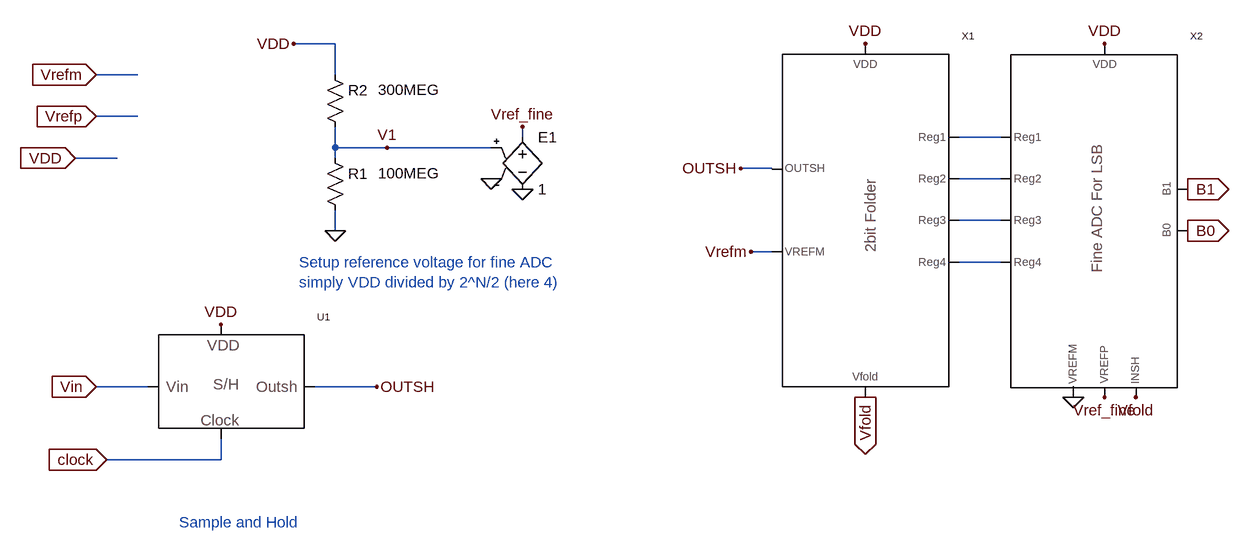
[diagram p0: schematic 2_bit_Folding_ADC.asc]
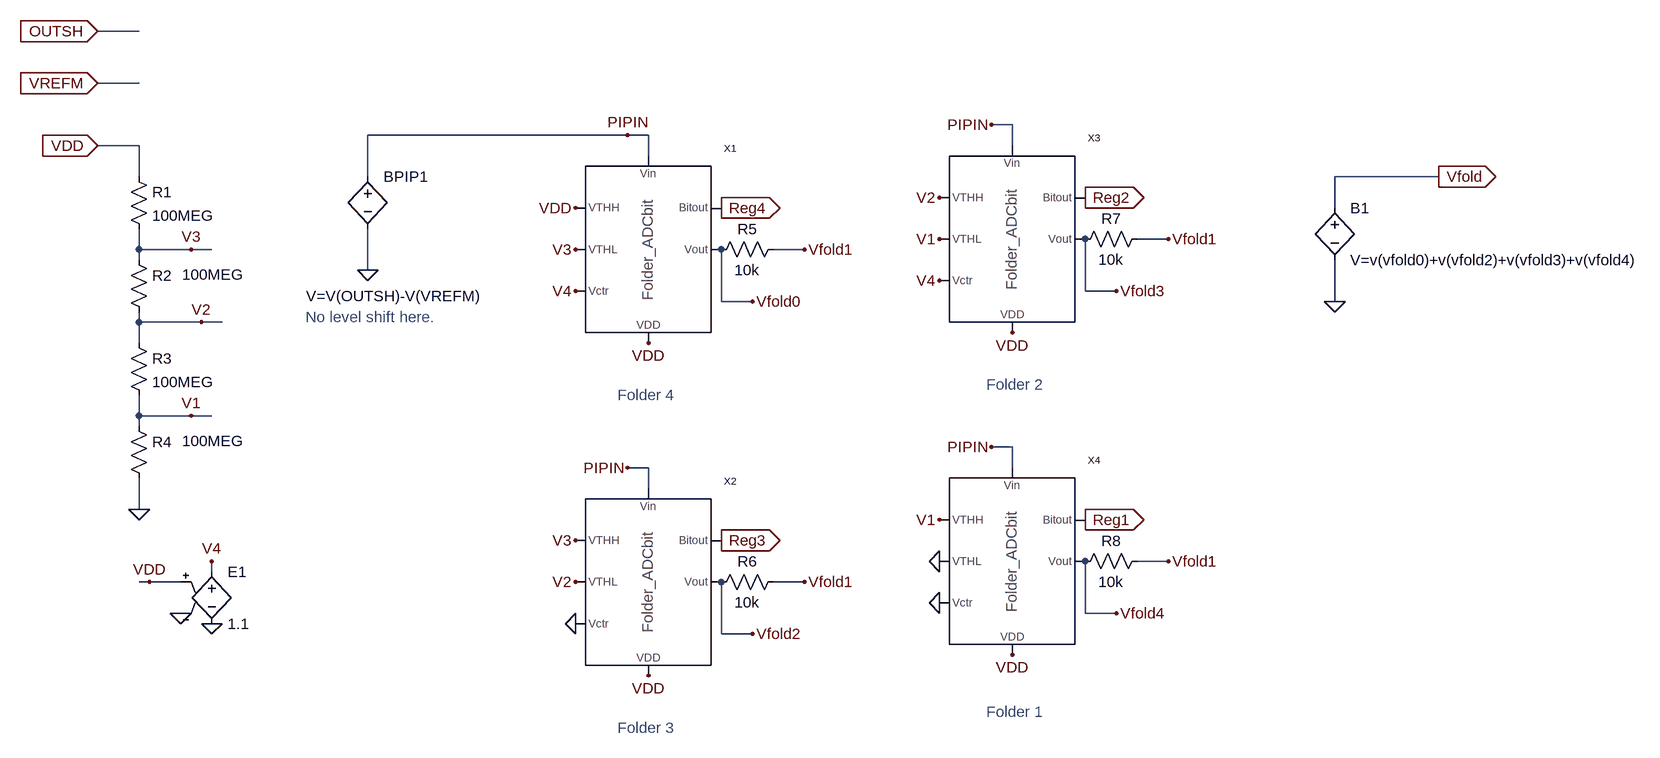
[diagram p1: sub-circuit 2bit_folder.asc]
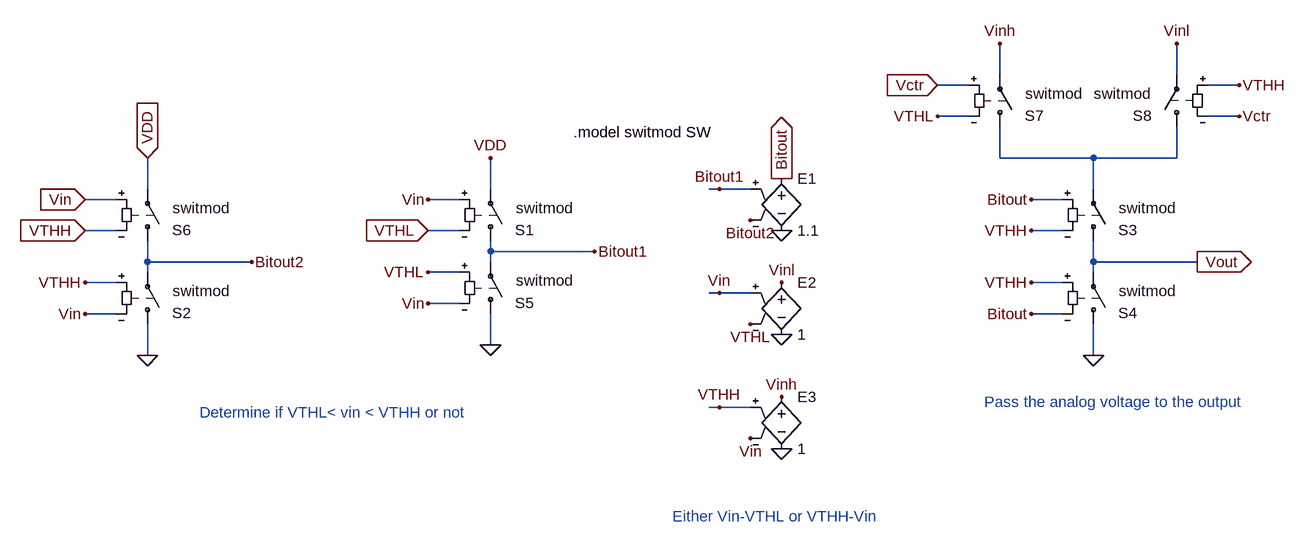
[diagram p2: sub-circuit folder_adcbit.asc]
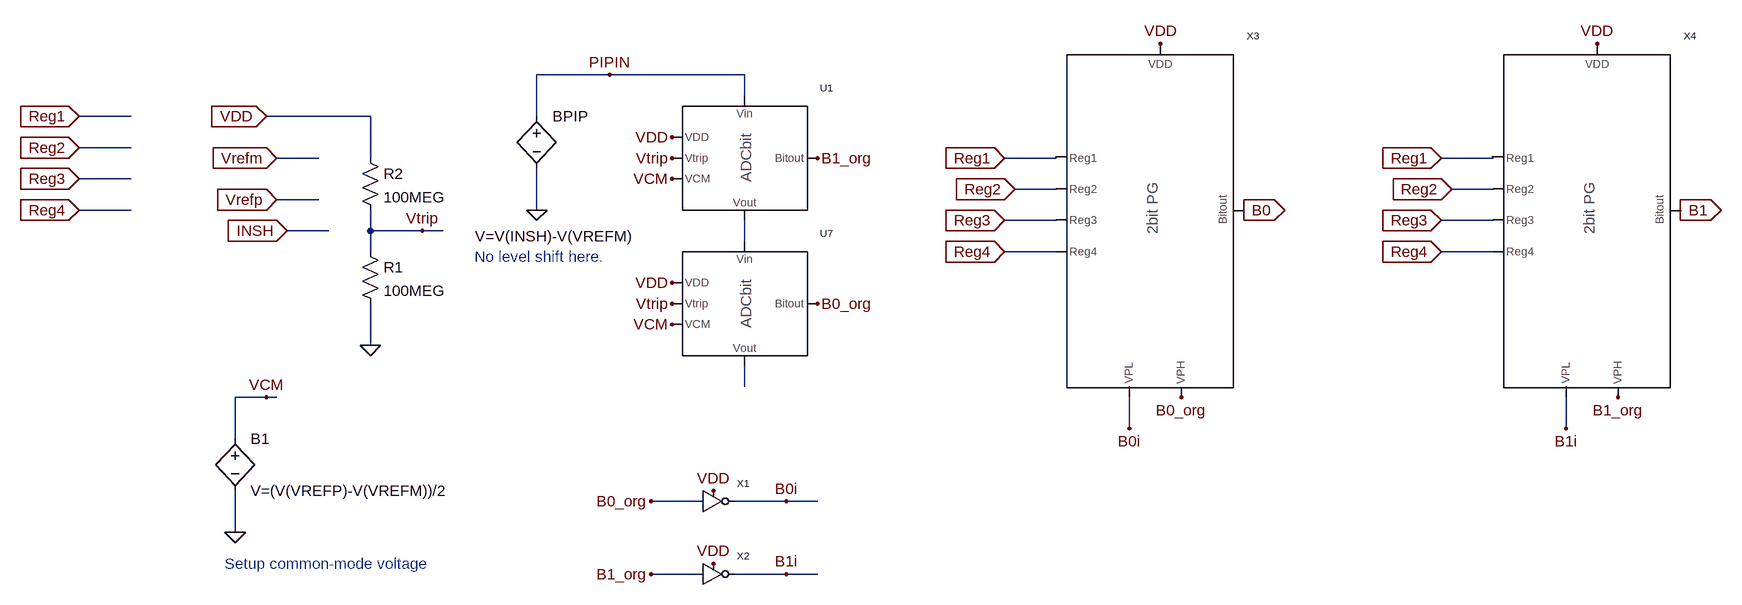
[diagram p3: sub-circuit 2_bit_fine_adc_lsb.asc]
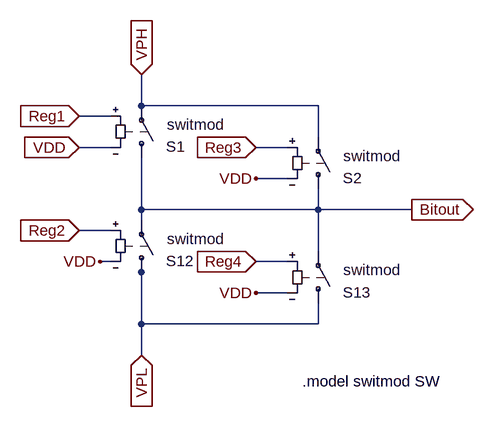
[diagram p4: sub-circuit 2bit_pg.asc]
2_bit_Folding_ADC.asc, the LTspice schematic file:
Version 4
SHEET 1 880 680
WIRE -1184 -960 -1248 -960
WIRE -1488 -912 -1552 -912
WIRE -1184 -912 -1184 -960
WIRE -1488 -848 -1552 -848
WIRE -896 -816 -896 -832
WIRE -160 -816 -224 -816
WIRE -1184 -800 -1184 -832
WIRE -1104 -800 -1184 -800
WIRE -944 -800 -1104 -800
WIRE -1520 -784 -1584 -784
WIRE -1184 -784 -1184 -800
WIRE -512 -768 -560 -768
WIRE -160 -752 -224 -752
WIRE -160 -688 -224 -688
WIRE -1184 -672 -1184 -704
WIRE -512 -640 -544 -640
WIRE -160 -624 -224 -624
WIRE -1472 -432 -1552 -432
WIRE -1120 -432 -1216 -432
WIRE -1360 -320 -1360 -352
WIRE -1360 -320 -1536 -320
FLAG -1536 -320 clock
IOPIN -1536 -320 In
FLAG -1120 -432 OUTSH
FLAG -1184 -672 0
FLAG -1248 -960 VDD
FLAG -1552 -432 Vin
IOPIN -1552 -432 In
FLAG -1552 -912 Vrefm
IOPIN -1552 -912 In
FLAG -1552 -848 Vrefp
IOPIN -1552 -848 In
FLAG -1360 -528 VDD
FLAG -1104 -800 V1
FLAG 128 -672 B0
IOPIN 128 -672 Out
FLAG -896 -736 0
FLAG -896 -832 Vref_fine
FLAG -944 -752 0
FLAG -544 -640 Vrefm
FLAG -368 -960 VDD
FLAG -368 -416 Vfold
IOPIN -368 -416 Out
FLAG -1584 -784 VDD
IOPIN -1584 -784 In
FLAG 0 -416 Vref_fine
FLAG -48 -416 0
FLAG 48 -416 Vfold
FLAG 0 -960 VDD
FLAG -560 -768 OUTSH
FLAG 128 -736 B1
IOPIN 128 -736 Out
SYMBOL Sample_and_hold -1456 -368 R0
SYMATTR InstName U1
SYMBOL res -1200 -928 R0
WINDOW 3 82 39 Left 0
SYMATTR Value 300MEG
SYMATTR InstName R2
SYMBOL res -1200 -800 R0
WINDOW 3 82 39 Left 0
SYMATTR Value 100MEG
SYMATTR InstName R1
SYMBOL e -896 -832 R0
SYMATTR InstName E1
SYMATTR Value 1
SYMBOL 2bit_folder -448 -560 R0
SYMATTR InstName X1
SYMBOL 2_bit_fine_adc_lsb 0 -640 R0
SYMATTR InstName X2
TEXT -1424 -224 Left 0 ;Sample and Hold
TEXT -1240 -624 Left 0 ;Setup reference voltage for fine ADC\nsimply VDD divided by 2^N/2 (here 4)

2bit_folder.asc, the sub-circuit schematic file:
Version 4
SHEET 1 880 680
WIRE -1984 -1616 -2048 -1616
WIRE -1984 -1536 -2048 -1536
WIRE -640 -1472 -672 -1472
WIRE -1232 -1456 -1632 -1456
WIRE -1200 -1456 -1232 -1456
WIRE -1984 -1440 -2048 -1440
WIRE -640 -1440 -640 -1472
WIRE -1200 -1424 -1200 -1456
WIRE -1984 -1392 -1984 -1440
WIRE -1632 -1392 -1632 -1456
WIRE 16 -1392 -144 -1392
WIRE -144 -1344 -144 -1392
WIRE -400 -1296 -448 -1296
WIRE -1984 -1280 -1984 -1312
WIRE -1904 -1280 -1984 -1280
WIRE -1872 -1280 -1904 -1280
WIRE -960 -1280 -1008 -1280
WIRE -1984 -1264 -1984 -1280
WIRE -1632 -1248 -1632 -1312
WIRE -528 -1216 -528 -1296
WIRE -480 -1216 -528 -1216
WIRE -1088 -1200 -1088 -1280
WIRE -1040 -1200 -1088 -1200
WIRE -144 -1200 -144 -1264
WIRE -1984 -1168 -1984 -1184
WIRE -1888 -1168 -1984 -1168
WIRE -1856 -1168 -1888 -1168
WIRE -1984 -1136 -1984 -1168
WIRE -1984 -1024 -1984 -1056
WIRE -1904 -1024 -1984 -1024
WIRE -1872 -1024 -1904 -1024
WIRE -1984 -1008 -1984 -1024
WIRE -640 -976 -672 -976
WIRE -1200 -944 -1232 -944
WIRE -640 -944 -640 -976
WIRE -1200 -912 -1200 -944
WIRE -1984 -880 -1984 -928
WIRE -400 -800 -448 -800
WIRE -1872 -784 -1872 -800
WIRE -1968 -768 -1984 -768
WIRE -1920 -768 -1968 -768
WIRE -960 -768 -1008 -768
WIRE -528 -720 -528 -800
WIRE -480 -720 -528 -720
WIRE -1088 -688 -1088 -768
WIRE -1040 -688 -1088 -688
FLAG -1984 -880 0
FLAG -2048 -1440 VDD
IOPIN -2048 -1440 In
FLAG -1632 -1248 0
FLAG -1312 -1280 V3
FLAG -1312 -1344 VDD
FLAG -1232 -1456 PIPIN
FLAG -1904 -1280 V3
FLAG -1200 -1136 VDD
FLAG -1312 -1216 V4
FLAG -1872 -704 0
FLAG -1872 -800 V4
FLAG -1920 -720 0
FLAG -1968 -768 VDD
FLAG -2048 -1536 VREFM
IOPIN -2048 -1536 In
FLAG -2048 -1616 OUTSH
IOPIN -2048 -1616 In
FLAG -1088 -1344 Reg4
IOPIN -1088 -1344 Out
FLAG -1040 -1200 Vfold0
FLAG -144 -1200 0
FLAG 16 -1392 Vfold
IOPIN 16 -1392 Out
FLAG -1312 -768 V2
FLAG -1312 -832 V3
FLAG -1232 -944 PIPIN
FLAG -1200 -624 VDD
FLAG -1312 -704 0
FLAG -1088 -832 Reg3
IOPIN -1088 -832 Out
FLAG -1040 -688 Vfold2
FLAG -960 -1280 Vfold1
FLAG -960 -768 Vfold1
FLAG -752 -1296 V1
FLAG -752 -1360 V2
FLAG -672 -1472 PIPIN
FLAG -640 -1152 VDD
FLAG -752 -1232 V4
FLAG -528 -1360 Reg2
IOPIN -528 -1360 Out
FLAG -480 -1216 Vfold3
FLAG -400 -1296 Vfold1
FLAG -752 -800 0
FLAG -752 -864 V1
FLAG -672 -976 PIPIN
FLAG -640 -656 VDD
FLAG -752 -736 0
FLAG -528 -864 Reg1
IOPIN -528 -864 Out
FLAG -480 -720 Vfold4
FLAG -400 -800 Vfold1
FLAG -1904 -1024 V1
FLAG -1888 -1168 V2
SYMBOL res -2000 -1408 R0
SYMATTR InstName R1
SYMATTR Value 100MEG
SYMBOL bv -1632 -1408 R0
WINDOW 3 -95 200 Left 0
SYMATTR Value V=V(OUTSH)-V(VREFM)
SYMATTR InstName BPIP1
SYMBOL res -2000 -1280 R0
WINDOW 3 82 39 Left 0
SYMATTR Value 100MEG
SYMATTR InstName R2
SYMBOL Folder_ADCbit -1344 -1312 R0
SYMATTR InstName X1
SYMBOL res -992 -1296 R90
WINDOW 0 0 56 VBottom 0
WINDOW 3 32 56 VTop 0
SYMATTR InstName R5
SYMATTR Value 10k
SYMBOL e -1872 -800 R0
SYMATTR InstName E1
SYMATTR Value 1.1
SYMBOL bv -144 -1360 R0
SYMATTR InstName B1
SYMATTR Value V=v(vfold0)+v(vfold2)+v(vfold3)+v(vfold4)
SYMBOL Folder_ADCbit -1344 -800 R0
SYMATTR InstName X2
SYMBOL res -992 -784 R90
WINDOW 0 0 56 VBottom 0
WINDOW 3 32 56 VTop 0
SYMATTR InstName R6
SYMATTR Value 10k
SYMBOL Folder_ADCbit -784 -1328 R0
SYMATTR InstName X3
SYMBOL res -432 -1312 R90
WINDOW 0 0 56 VBottom 0
WINDOW 3 32 56 VTop 0
SYMATTR InstName R7
SYMATTR Value 10k
SYMBOL Folder_ADCbit -784 -832 R0
SYMATTR InstName X4
SYMBOL res -432 -816 R90
WINDOW 0 0 56 VBottom 0
WINDOW 3 32 56 VTop 0
SYMATTR InstName R8
SYMATTR Value 10k
SYMBOL res -2000 -1152 R0
SYMATTR InstName R3
SYMATTR Value 100MEG
SYMBOL res -2000 -1024 R0
WINDOW 3 82 39 Left 0
SYMATTR Value 100MEG
SYMATTR InstName R4
TEXT -1728 -1176 Left 0 ;No level shift here.
TEXT -1248 -1056 Left 0 ;Folder 4
TEXT -680 -1072 Left 0 ;Folder 2
TEXT -680 -568 Left 0 ;Folder 1
TEXT -1248 -544 Left 0 ;Folder 3

folder_adcbit.asc, the sub-circuit schematic file:
Version 4
SHEET 1 880 680
WIRE 32 -224 32 -272
WIRE 304 -224 304 -272
WIRE -16 -208 -64 -208
WIRE 400 -208 352 -208
WIRE -16 -160 -64 -160
WIRE 400 -160 352 -160
WIRE 32 -96 32 -144
WIRE 176 -96 32 -96
WIRE 304 -96 304 -144
WIRE 304 -96 176 -96
WIRE -1280 -48 -1280 -96
WIRE -752 -48 -752 -96
WIRE -400 -48 -416 -48
WIRE -352 -48 -400 -48
WIRE 176 -48 176 -96
WIRE -1328 -32 -1376 -32
WIRE -800 -32 -848 -32
WIRE 128 -32 80 -32
WIRE -1328 16 -1376 16
WIRE -800 16 -848 16
WIRE 128 16 80 16
WIRE -752 48 -752 32
WIRE -592 48 -752 48
WIRE -1280 64 -1280 32
WIRE -1120 64 -1280 64
WIRE -752 64 -752 48
WIRE 176 64 176 32
WIRE 336 64 176 64
WIRE -1280 80 -1280 64
WIRE -800 80 -848 80
WIRE 176 80 176 64
WIRE -1328 96 -1376 96
WIRE 128 96 80 96
WIRE -400 112 -416 112
WIRE -352 112 -400 112
WIRE -800 128 -848 128
WIRE -1328 144 -1376 144
WIRE 128 144 80 144
WIRE -752 192 -752 144
WIRE -1280 208 -1280 160
WIRE 176 208 176 160
WIRE -400 288 -416 288
WIRE -352 288 -400 288
FLAG -848 -32 Vin
FLAG -848 16 VTHL
IOPIN -848 16 In
FLAG -1376 96 VTHH
FLAG -1376 144 Vin
FLAG -1120 64 Bitout2
FLAG -1280 208 0
FLAG -752 -96 VDD
FLAG 80 -32 Bitout
FLAG 80 16 VTHH
FLAG 80 96 VTHH
FLAG 80 144 Bitout
FLAG 336 64 Vout
IOPIN 336 64 Out
FLAG -304 16 0
FLAG -304 176 0
FLAG -304 -64 Bitout
IOPIN -304 -64 Out
FLAG -304 96 Vinl
FLAG -352 160 VTHL
FLAG -352 0 Bitout2
FLAG -400 -48 Bitout1
FLAG -400 112 Vin
FLAG -848 80 VTHL
FLAG -848 128 Vin
FLAG -592 48 Bitout1
FLAG -752 192 0
FLAG -1376 -32 Vin
IOPIN -1376 -32 In
FLAG -1376 16 VTHH
IOPIN -1376 16 In
FLAG -1280 -96 VDD
IOPIN -1280 -96 In
FLAG 176 208 0
FLAG -304 352 0
FLAG -304 272 Vinh
FLAG -352 336 Vin
FLAG -400 288 VTHH
FLAG -64 -208 Vctr
IOPIN -64 -208 In
FLAG -64 -160 VTHL
FLAG 32 -272 Vinh
FLAG 400 -208 VTHH
FLAG 400 -160 Vctr
FLAG 304 -272 Vinl
SYMBOL sw -752 48 M180
WINDOW 3 24 -12 Left 0
WINDOW 38 39 67 Left 0
WINDOW 0 38 33 Left 0
SYMATTR Value ""
SYMATTR SpiceModel switmod
SYMATTR InstName S1
SYMBOL sw -1280 176 M180
WINDOW 3 24 -12 Left 0
WINDOW 38 39 67 Left 0
WINDOW 0 38 33 Left 0
SYMATTR Value ""
SYMATTR SpiceModel switmod
SYMATTR InstName S2
SYMBOL sw 176 48 M180
WINDOW 3 24 -12 Left 0
WINDOW 38 39 67 Left 0
WINDOW 0 38 33 Left 0
SYMATTR Value ""
SYMATTR SpiceModel switmod
SYMATTR InstName S3
SYMBOL sw 176 176 M180
WINDOW 3 24 -12 Left 0
WINDOW 38 39 67 Left 0
WINDOW 0 38 33 Left 0
SYMATTR Value ""
SYMATTR SpiceModel switmod
SYMATTR InstName S4
SYMBOL e -304 -80 R0
SYMATTR InstName E1
SYMATTR Value 1.1
SYMBOL e -304 80 R0
SYMATTR InstName E2
SYMATTR Value 1
SYMBOL sw -752 160 M180
WINDOW 3 24 -12 Left 0
WINDOW 38 39 67 Left 0
WINDOW 0 38 33 Left 0
SYMATTR Value ""
SYMATTR SpiceModel switmod
SYMATTR InstName S5
SYMBOL sw -1280 48 M180
WINDOW 3 24 -12 Left 0
WINDOW 38 39 67 Left 0
WINDOW 0 38 33 Left 0
SYMATTR Value ""
SYMATTR SpiceModel switmod
SYMATTR InstName S6
SYMBOL e -304 256 R0
SYMATTR InstName E3
SYMATTR Value 1
SYMBOL sw 32 -128 M180
WINDOW 3 24 -12 Left 0
WINDOW 38 39 67 Left 0
WINDOW 0 38 33 Left 0
SYMATTR Value ""
SYMATTR SpiceModel switmod
SYMATTR InstName S7
SYMBOL sw 304 -128 R180
WINDOW 3 24 -12 Left 0
WINDOW 38 39 67 Left 0
WINDOW 0 38 33 Left 0
SYMATTR Value ""
SYMATTR SpiceModel switmod
SYMATTR InstName S8
TEXT -1200 296 Left 0 ;Determine if VTHL< vin < VTHH or not
TEXT -472 456 Left 0 ;Either Vin-VTHL or VTHH-Vin
TEXT 8 280 Left 0 ;Pass the analog voltage to the output
TEXT -624 -136 Left 0 !.model switmod SW

2_bit_fine_adc_lsb.asc, the sub-circuit schematic file:
Version 4
SHEET 1 4400 868
WIRE 800 -1120 688 -1120
WIRE 1008 -1120 800 -1120
WIRE 1008 -1088 1008 -1120
WIRE 64 -1056 -16 -1056
WIRE 432 -1056 272 -1056
WIRE 688 -1056 688 -1120
WIRE 64 -1008 -16 -1008
WIRE 352 -992 288 -992
WIRE 432 -992 432 -1056
WIRE 1488 -992 1408 -992
WIRE 2160 -992 2080 -992
WIRE 64 -960 -16 -960
WIRE 1488 -944 1424 -944
WIRE 2160 -944 2096 -944
WIRE 352 -928 288 -928
WIRE 64 -912 -16 -912
WIRE 688 -912 688 -976
WIRE 1488 -896 1408 -896
WIRE 2160 -896 2080 -896
WIRE 368 -880 304 -880
WIRE 432 -880 432 -912
WIRE 512 -880 432 -880
WIRE 544 -880 512 -880
WIRE 1008 -864 1008 -896
WIRE 432 -848 432 -880
WIRE 1488 -848 1408 -848
WIRE 2160 -848 2080 -848
WIRE 432 -704 432 -768
WIRE 1008 -640 1008 -672
WIRE 272 -624 224 -624
WIRE 288 -624 272 -624
WIRE 1600 -576 1600 -624
WIRE 2272 -576 2272 -624
WIRE 224 -560 224 -624
WIRE 944 -464 864 -464
WIRE 1072 -464 992 -464
WIRE 1120 -464 1072 -464
WIRE 224 -416 224 -480
WIRE 944 -352 864 -352
WIRE 1072 -352 992 -352
WIRE 1120 -352 1072 -352
FLAG 512 -880 Vtrip
FLAG 432 -704 0
FLAG 272 -1056 VDD
IOPIN 272 -1056 In
FLAG 224 -416 0
FLAG 272 -624 VCM
FLAG 688 -912 0
FLAG 896 -992 Vtrip
FLAG 896 -1024 VDD
FLAG 896 -960 VCM
FLAG 896 -768 Vtrip
FLAG 896 -800 VDD
FLAG 896 -736 VCM
FLAG 1120 -768 B0_org
FLAG 800 -1120 PIPIN
FLAG 288 -992 Vrefm
IOPIN 288 -992 In
FLAG 288 -928 Vrefp
IOPIN 288 -928 In
FLAG 1120 -992 B1_org
FLAG 304 -880 INSH
IOPIN 304 -880 In
FLAG -16 -1056 Reg1
IOPIN -16 -1056 In
FLAG -16 -1008 Reg2
IOPIN -16 -1008 In
FLAG -16 -960 Reg3
IOPIN -16 -960 In
FLAG -16 -912 Reg4
IOPIN -16 -912 In
FLAG 864 -464 B0_org
FLAG 960 -480 VDD
FLAG 1072 -464 B0i
FLAG 864 -352 B1_org
FLAG 960 -368 VDD
FLAG 1072 -352 B1i
FLAG 1648 -1168 VDD
FLAG 1408 -992 Reg1
IOPIN 1408 -992 In
FLAG 1424 -944 Reg2
IOPIN 1424 -944 In
FLAG 1408 -896 Reg3
IOPIN 1408 -896 In
FLAG 1408 -848 Reg4
IOPIN 1408 -848 In
FLAG 2320 -1168 VDD
FLAG 1680 -624 B0_org
FLAG 1600 -576 B0i
FLAG 2272 -576 B1i
FLAG 2352 -624 B1_org
FLAG 2448 -912 B1
IOPIN 2448 -912 Out
FLAG 1776 -912 B0
IOPIN 1776 -912 Out
FLAG 2080 -992 Reg1
IOPIN 2080 -992 In
FLAG 2096 -944 Reg2
IOPIN 2096 -944 In
FLAG 2080 -896 Reg3
IOPIN 2080 -896 In
FLAG 2080 -848 Reg4
IOPIN 2080 -848 In
SYMBOL res 416 -864 R0
SYMATTR InstName R1
SYMATTR Value 100MEG
SYMBOL res 416 -1008 R0
SYMATTR InstName R2
SYMATTR Value 100MEG
SYMBOL bv 224 -576 R0
SYMATTR InstName B1
SYMATTR Value V=(V(VREFP)-V(VREFM))/2
SYMBOL bv 688 -1072 R0
WINDOW 3 -95 200 Left 0
SYMATTR Value V=V(INSH)-V(VREFM)
SYMATTR InstName BPIP
SYMBOL ADCbit 864 -976 R0
SYMATTR InstName U1
SYMBOL ADCbit 864 -752 R0
SYMATTR InstName U7
SYMBOL inverter 944 -464 R0
SYMATTR InstName X1
SYMBOL inverter 944 -352 R0
SYMATTR InstName X2
SYMBOL 2bit_pg 1648 -848 R0
SYMATTR InstName X3
SYMBOL 2bit_pg 2320 -848 R0
SYMATTR InstName X4
TEXT 592 -840 Left 0 ;No level shift here.
TEXT 208 -368 Left 0 ;Setup common-mode voltage

2bit_pg.asc, the sub-circuit schematic file:
Version 4
SHEET 1 3216 696
WIRE 864 -1296 864 -1344
WIRE 1136 -1296 864 -1296
WIRE 816 -1280 768 -1280
WIRE 1136 -1248 1136 -1296
WIRE 816 -1232 768 -1232
WIRE 1088 -1232 1040 -1232
WIRE 1088 -1184 1040 -1184
WIRE 864 -1136 864 -1216
WIRE 1136 -1136 1136 -1168
WIRE 1136 -1136 864 -1136
WIRE 1280 -1136 1136 -1136
WIRE 864 -1120 864 -1136
WIRE 816 -1104 768 -1104
WIRE 1136 -1072 1136 -1136
WIRE 816 -1056 800 -1056
WIRE 1088 -1056 1040 -1056
WIRE 864 -1040 864 -1056
WIRE 1088 -1008 1040 -1008
WIRE 864 -960 864 -1040
WIRE 1136 -960 1136 -992
WIRE 1136 -960 864 -960
WIRE 864 -912 864 -960
FLAG 1280 -1136 Bitout
IOPIN 1280 -1136 Out
FLAG 864 -912 VPL
IOPIN 864 -912 In
FLAG 864 -1344 VPH
IOPIN 864 -1344 In
FLAG 768 -1232 VDD
IOPIN 768 -1232 In
FLAG 768 -1280 Reg1
IOPIN 768 -1280 In
FLAG 1040 -1184 VDD
FLAG 1040 -1232 Reg3
IOPIN 1040 -1232 In
FLAG 768 -1104 Reg2
IOPIN 768 -1104 In
FLAG 1040 -1056 Reg4
IOPIN 1040 -1056 In
FLAG 1040 -1008 VDD
FLAG 800 -1056 VDD
SYMBOL sw 864 -1200 M180
WINDOW 3 24 -12 Left 0
WINDOW 38 39 67 Left 0
WINDOW 0 38 33 Left 0
SYMATTR Value ""
SYMATTR SpiceModel switmod
SYMATTR InstName S1
SYMBOL sw 1136 -1152 M180
WINDOW 3 24 -12 Left 0
WINDOW 38 39 67 Left 0
WINDOW 0 38 33 Left 0
SYMATTR Value ""
SYMATTR SpiceModel switmod
SYMATTR InstName S2
SYMBOL sw 864 -1024 M180
WINDOW 3 24 -12 Left 0
WINDOW 38 39 67 Left 0
WINDOW 0 38 33 Left 0
SYMATTR Value ""
SYMATTR SpiceModel switmod
SYMATTR InstName S12
SYMBOL sw 1136 -976 M180
WINDOW 3 24 -12 Left 0
WINDOW 38 39 67 Left 0
WINDOW 0 38 33 Left 0
SYMATTR Value ""
SYMATTR SpiceModel switmod
SYMATTR InstName S13
TEXT 1112 -872 Left 0 !.model switmod SW

The netlist it stands for:
* 2_bit_Folding_ADC.asc
XU1 Vin OUTSH clock VDD Sample_and_hold  ; pins Vin Outsh Clock VDD
R2 VDD V1 300MEG
R1 V1 0 100MEG
E1 Vref_fine 0 V1 0 1
XX1 VDD OUTSH Vfold Vrefm N001 N002 N003 N004 2bit_folder
XX2 VDD 0 Vfold B0 N001 N002 N003 N004 Vref_fine B1 2_bit_fine_adc_lsb

* block symbol definitions
.subckt 2bit_folder VDD OUTSH Vfold VREFM Reg1 Reg2 Reg3 Reg4
R1 VDD V3 100MEG
BPIP1 PIPIN 0 V=V(OUTSH)-V(VREFM)
R2 V3 V2 100MEG
XX1 VDD V3 V4 PIPIN Vfold0 VDD Reg4 folder_adcbit
R5 Vfold1 Vfold0 10k
E1 V4 0 VDD 0 1.1
B1 Vfold 0 V=v(vfold0)+v(vfold2)+v(vfold3)+v(vfold4)
XX2 V3 V2 0 PIPIN Vfold2 VDD Reg3 folder_adcbit
R6 Vfold1 Vfold2 10k
XX3 V2 V1 V4 PIPIN Vfold3 VDD Reg2 folder_adcbit
R7 Vfold1 Vfold3 10k
XX4 V1 0 0 PIPIN Vfold4 VDD Reg1 folder_adcbit
R8 Vfold1 Vfold4 10k
R3 V2 V1 100MEG
R4 V1 0 100MEG
* No level shift here.
* Folder 4
* Folder 2
* Folder 1
* Folder 3
.ends 2bit_folder

.subckt folder_adcbit VTHH VTHL Vctr Vin Vout VDD Bitout
S1 Bitout1 VDD Vin VTHL switmod
S2 0 Bitout2 VTHH Vin switmod
S3 Vout N001 Bitout VTHH switmod
S4 0 Vout VTHH Bitout switmod
E1 Bitout 0 Bitout1 Bitout2 1.1
E2 Vinl 0 Vin VTHL 1
S5 0 Bitout1 VTHL Vin switmod
S6 Bitout2 VDD Vin VTHH switmod
E3 Vinh 0 VTHH Vin 1
S7 N001 Vinh Vctr VTHL switmod
S8 N001 Vinl VTHH Vctr switmod
* Determine if VTHL< vin < VTHH or not
* Either Vin-VTHL or VTHH-Vin
* Pass the analog voltage to the output
.model switmod SW
.ends folder_adcbit

.subckt 2_bit_fine_adc_lsb VDD VREFM INSH B0 Reg1 Reg2 Reg3 Reg4 VREFP B1
R1 Vtrip 0 100MEG
R2 VDD Vtrip 100MEG
B1 VCM 0 V=(V(VREFP)-V(VREFM))/2
BPIP PIPIN 0 V=V(INSH)-V(VREFM)
XU1 VDD Vtrip VCM PIPIN B1_org N001 ADCbit  ; pins VDD Vtrip VCM Vin Bitout Vout
XU7 VDD Vtrip VCM N001 B0_org N002 ADCbit  ; pins VDD Vtrip VCM Vin Bitout Vout
XX1 B0_org B0i VDD inverter  ; pins In Out VDD
XX2 B1_org B1i VDD inverter  ; pins In Out VDD
XX3 VDD B0i B0 B0_org Reg1 Reg2 Reg3 Reg4 2bit_pg
XX4 VDD B1i B1 B1_org Reg1 Reg2 Reg3 Reg4 2bit_pg
* No level shift here.
* Setup common-mode voltage
.ends 2_bit_fine_adc_lsb

.subckt 2bit_pg VDD VPL Bitout VPH Reg1 Reg2 Reg3 Reg4
S1 Bitout VPH Reg1 VDD switmod
S2 Bitout VPH Reg3 VDD switmod
S12 VPL Bitout Reg2 VDD switmod
S13 VPL Bitout Reg4 VDD switmod
.model switmod SW
.ends 2bit_pg

* Sample and Hold
* Setup reference voltage for fine ADC
* simply VDD divided by 2^N/2 (here 4)
.backanno
.end